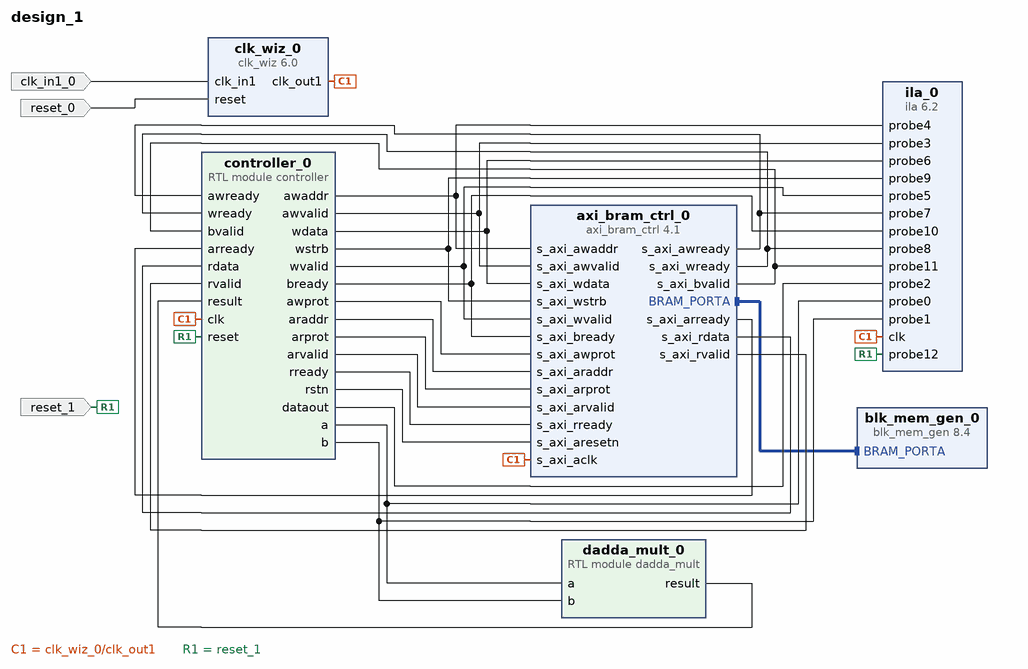
[diagram p0: block diagram of the top level]
# Vivado block design design_1, xc7z020clg400-1, Vivado 2020.2
create_bd_design design_1

create_bd_port -dir I -type rst reset_0
set_property -dict {CONFIG.POLARITY ACTIVE_HIGH} [get_bd_ports reset_0]
create_bd_port -dir I -type clk clk_in1_0
create_bd_port -dir I -type rst reset_1
set_property -dict {CONFIG.POLARITY ACTIVE_HIGH} [get_bd_ports reset_1]

create_bd_cell -type ip -vlnv xilinx.com:ip:axi_bram_ctrl:4.1 axi_bram_ctrl_0
set_property -dict {CONFIG.PROTOCOL AXI4LITE CONFIG.SINGLE_PORT_BRAM 1} [get_bd_cells axi_bram_ctrl_0]
create_bd_cell -type ip -vlnv xilinx.com:ip:blk_mem_gen:8.4 blk_mem_gen_0
set_property -dict [list \
  CONFIG.Coe_File c:/Users/sbmur/Downloads/daddaMult1.coe \
  CONFIG.Enable_32bit_Address false \
  CONFIG.Fill_Remaining_Memory_Locations true \
  CONFIG.Load_Init_File true \
  CONFIG.Register_PortA_Output_of_Memory_Primitives false \
  CONFIG.Use_Byte_Write_Enable false \
  CONFIG.Use_RSTA_Pin false \
  CONFIG.Write_Depth_A 32768 \
  CONFIG.use_bram_block Stand_Alone \
] [get_bd_cells blk_mem_gen_0]
create_bd_cell -type module -reference dadda_mult dadda_mult_0
create_bd_cell -type ip -vlnv xilinx.com:ip:ila:6.2 ila_0
set_property -dict [list \
  CONFIG.C_ENABLE_ILA_AXI_MON false \
  CONFIG.C_MONITOR_TYPE Native \
  CONFIG.C_NUM_OF_PROBES 13 \
  CONFIG.C_PROBE0_WIDTH 16 \
  CONFIG.C_PROBE1_WIDTH 16 \
  CONFIG.C_PROBE2_WIDTH 32 \
  CONFIG.C_PROBE4_WIDTH 15 \
  CONFIG.C_PROBE6_WIDTH 32 \
  CONFIG.C_PROBE9_WIDTH 4 \
] [get_bd_cells ila_0]
create_bd_cell -type ip -vlnv xilinx.com:ip:clk_wiz:6.0 clk_wiz_0
set_property -dict [list \
  CONFIG.CLKOUT1_JITTER 296.460 \
  CONFIG.CLKOUT1_PHASE_ERROR 293.793 \
  CONFIG.CLKOUT1_REQUESTED_OUT_FREQ 30.000 \
  CONFIG.MMCM_CLKFBOUT_MULT_F 49.875 \
  CONFIG.MMCM_CLKOUT0_DIVIDE_F 33.250 \
  CONFIG.MMCM_DIVCLK_DIVIDE 5 \
] [get_bd_cells clk_wiz_0]
create_bd_cell -type module -reference controller controller_0

# ---- connections ----

connect_bd_intf_net [get_bd_intf_pins axi_bram_ctrl_0/BRAM_PORTA] [get_bd_intf_pins blk_mem_gen_0/BRAM_PORTA]
connect_bd_net [get_bd_pins controller_0/awaddr] [get_bd_pins axi_bram_ctrl_0/s_axi_awaddr] [get_bd_pins ila_0/probe4]
connect_bd_net [get_bd_pins controller_0/awprot] [get_bd_pins axi_bram_ctrl_0/s_axi_awprot]
connect_bd_net [get_bd_pins controller_0/awvalid] [get_bd_pins axi_bram_ctrl_0/s_axi_awvalid] [get_bd_pins ila_0/probe3]
connect_bd_net [get_bd_pins axi_bram_ctrl_0/s_axi_awready] [get_bd_pins ila_0/probe7] [get_bd_pins controller_0/awready]
connect_bd_net [get_bd_pins controller_0/wdata] [get_bd_pins axi_bram_ctrl_0/s_axi_wdata] [get_bd_pins ila_0/probe6]
connect_bd_net [get_bd_pins controller_0/wstrb] [get_bd_pins axi_bram_ctrl_0/s_axi_wstrb] [get_bd_pins ila_0/probe9]
connect_bd_net [get_bd_pins controller_0/wvalid] [get_bd_pins axi_bram_ctrl_0/s_axi_wvalid] [get_bd_pins ila_0/probe5]
connect_bd_net [get_bd_pins axi_bram_ctrl_0/s_axi_wready] [get_bd_pins ila_0/probe8] [get_bd_pins controller_0/wready]
connect_bd_net [get_bd_pins axi_bram_ctrl_0/s_axi_bvalid] [get_bd_pins ila_0/probe11] [get_bd_pins controller_0/bvalid]
connect_bd_net [get_bd_pins controller_0/bready] [get_bd_pins axi_bram_ctrl_0/s_axi_bready] [get_bd_pins ila_0/probe10]
connect_bd_net [get_bd_pins controller_0/araddr] [get_bd_pins axi_bram_ctrl_0/s_axi_araddr]
connect_bd_net [get_bd_pins controller_0/arprot] [get_bd_pins axi_bram_ctrl_0/s_axi_arprot]
connect_bd_net [get_bd_pins controller_0/arvalid] [get_bd_pins axi_bram_ctrl_0/s_axi_arvalid]
connect_bd_net [get_bd_pins axi_bram_ctrl_0/s_axi_arready] [get_bd_pins controller_0/arready]
connect_bd_net [get_bd_pins axi_bram_ctrl_0/s_axi_rdata] [get_bd_pins controller_0/rdata]
connect_bd_net [get_bd_pins axi_bram_ctrl_0/s_axi_rvalid] [get_bd_pins controller_0/rvalid]
connect_bd_net [get_bd_pins controller_0/rready] [get_bd_pins axi_bram_ctrl_0/s_axi_rready]
connect_bd_net [get_bd_pins controller_0/rstn] [get_bd_pins axi_bram_ctrl_0/s_axi_aresetn]
connect_bd_net [get_bd_pins controller_0/a] [get_bd_pins dadda_mult_0/a] [get_bd_pins ila_0/probe0]
connect_bd_net [get_bd_pins controller_0/b] [get_bd_pins dadda_mult_0/b] [get_bd_pins ila_0/probe1]
connect_bd_net [get_bd_pins dadda_mult_0/result] [get_bd_pins controller_0/result]
connect_bd_net [get_bd_pins controller_0/dataout] [get_bd_pins ila_0/probe2]
connect_bd_net -net clk_in1_0_1 [get_bd_ports clk_in1_0] [get_bd_pins clk_wiz_0/clk_in1]
connect_bd_net [get_bd_pins clk_wiz_0/clk_out1] [get_bd_pins axi_bram_ctrl_0/s_axi_aclk] [get_bd_pins ila_0/clk] [get_bd_pins controller_0/clk]
connect_bd_net -net reset_0_1 [get_bd_ports reset_0] [get_bd_pins clk_wiz_0/reset]
connect_bd_net -net reset_1_1 [get_bd_ports reset_1] [get_bd_pins controller_0/reset] [get_bd_pins ila_0/probe12]

validate_bd_design
save_bd_design
